# EAGLE design motordrive2 (EAGLE 7.6.0)
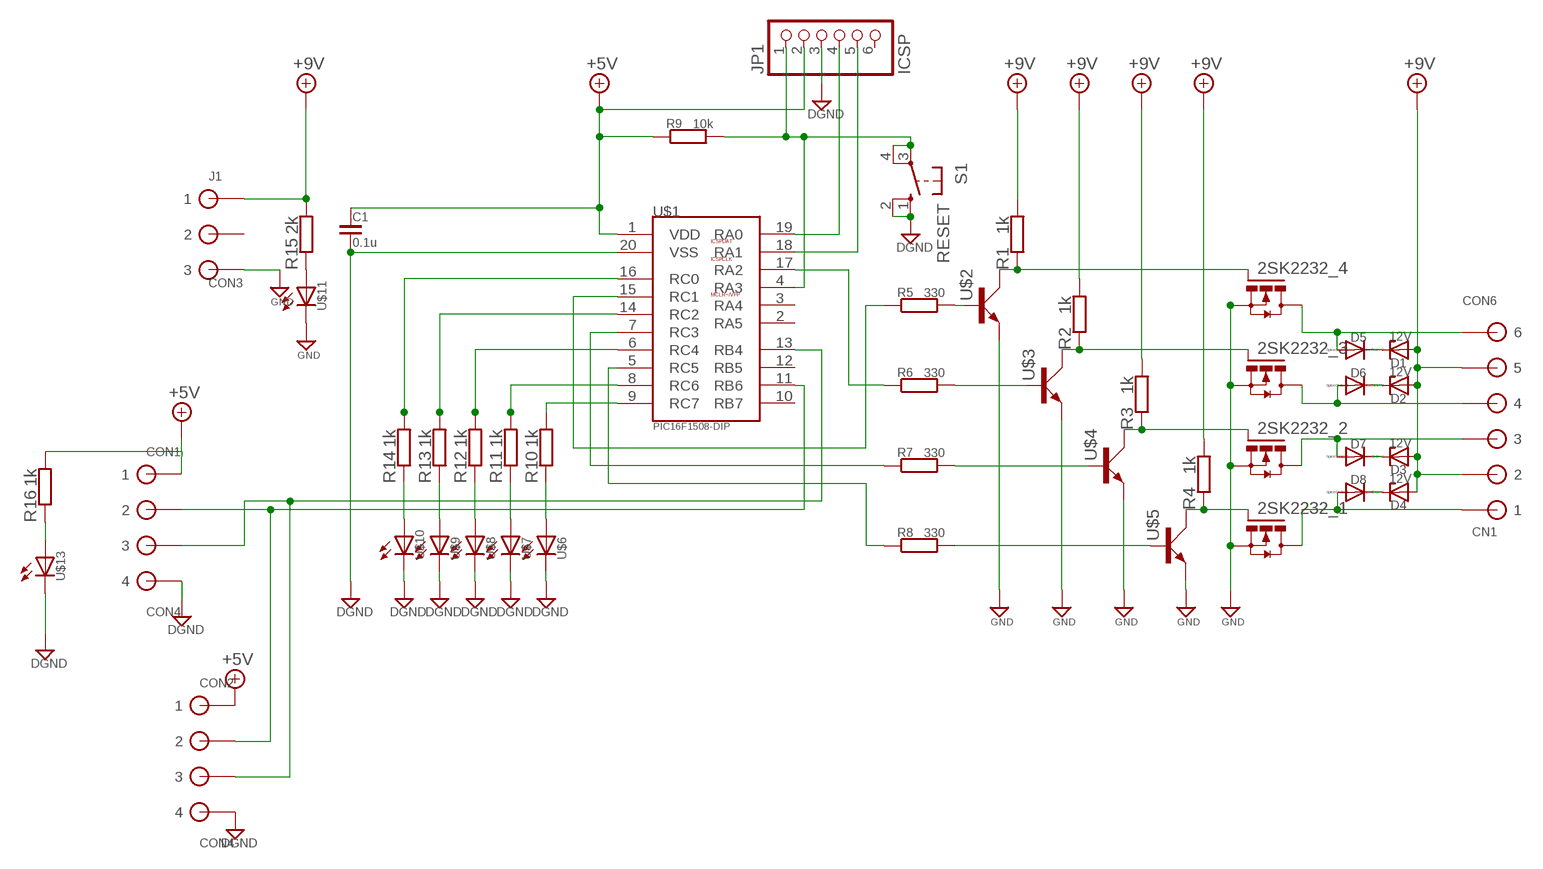
[diagram p0: schematic, sheet 1]

## Parts
2SK2232_1  TO-220(MOS-FET_N)  [TO-220]
2SK2232_2  TO-220(MOS-FET_N)  [TO-220]
2SK2232_3  TO-220(MOS-FET_N)  [TO-220]
2SK2232_4  TO-220(MOS-FET_N)  [TO-220]
C1  0.1u  (コンデンサ)セラミック075-032X103  [C075-032X103]
CN1  CON6  [CON6]
CON1  CON4  [CON4]
CON2  CON4  [CON4]
D1  12V  (汎用)ツェナーダイオードD=3  [DO41Z(D=3)]
D2  12V  (汎用)ツェナーダイオードD=3  [DO41Z(D=3)]
D3  12V  (汎用)ツェナーダイオードD=3  [DO41Z(D=3)]
D4  12V  (汎用)ツェナーダイオードD=3  [DO41Z(D=3)]
D5  (汎用)D=3  [DO41(D=3)]
D6  (汎用)D=3  [DO41(D=3)]
D7  (汎用)D=3  [DO41(D=3)]
D8  (汎用)D=3  [DO41(D=3)]
J1  CON3  [CON3]
JP1  ICSP  PINHD-1X6  [1X06]
R1  1k  抵抗(新JIS)0207/10  [0207/10]
R2  1k  抵抗(新JIS)0207/10  [0207/10]
R3  1k  抵抗(新JIS)0207/10  [0207/10]
R4  1k  抵抗(新JIS)0207/10  [0207/10]
R5  330  抵抗0207/10  [1/4W-H4_(0207/10)]
R6  330  抵抗0207/10  [1/4W-H4_(0207/10)]
R7  330  抵抗0207/10  [1/4W-H4_(0207/10)]
R8  330  抵抗0207/10  [1/4W-H4_(0207/10)]
R9  10k  抵抗0207/10  [1/4W-H4_(0207/10)]
R10  1k  抵抗(新JIS)0207/10  [0207/10]
R11  1k  抵抗(新JIS)0207/10  [0207/10]
R12  1k  抵抗(新JIS)0207/10  [0207/10]
R13  1k  抵抗(新JIS)0207/10  [0207/10]
R14  1k  抵抗(新JIS)0207/10  [0207/10]
R15  2k  抵抗(新JIS)0207/10  [0207/10]
R16  1k  抵抗(新JIS)0207/10  [0207/10]
S1  RESET  ノーマル4ピンタクトスイッチ  [B3F-10XX]
U$1  PIC16F1508-DIP  [DIP254P762X533-20]
U$2  TO-92(TRANSISTER_NPN)  [TO-92]
U$3  TO-92(TRANSISTER_NPN)  [TO-92]
U$4  TO-92(TRANSISTER_NPN)  [TO-92]
U$5  TO-92(TRANSISTER_NPN)  [TO-92]
U$6  LED(砲弾型)5  [LED5MM]
U$7  LED(砲弾型)5  [LED5MM]
U$8  LED(砲弾型)5  [LED5MM]
U$9  LED(砲弾型)5  [LED5MM]
U$10  LED(砲弾型)5  [LED5MM]
U$11  LED(砲弾型)5  [LED5MM]
U$13  LED(砲弾型)5  [LED5MM]

## Nets
+5V: C1.1 CON1.P$1 CON2.P$1 JP1.2 R9.1 R16.2 U$1.1(VDD)
+9V: CN1.P$2 CN1.P$5 D1.A D2.A D3.A D4.A J1.P$1 R1.2 R2.2 R3.2 R4.2 R15.2
DGND: C1.2 CON1.P$4 CON2.P$4 JP1.3 S1.1(S) S1.2(S1) U$1.20(VSS) U$6.K U$7.K U$8.K U$9.K U$10.K U$13.K
GND: 2SK2232_1.3(S) 2SK2232_2.3(S) 2SK2232_3.3(S) 2SK2232_4.3(S) J1.P$3 U$2.1(E) U$3.1(E) U$4.1(E) U$5.1(E) U$11.K
N$1: 2SK2232_1.2(D) CN1.P$1 D8.A
N$2: 2SK2232_2.2(D) CN1.P$3 D7.A
N$3: 2SK2232_3.2(D) CN1.P$4 D6.A
N$4: 2SK2232_4.2(D) CN1.P$6 D5.A
N$5: R8.1 U$1.5(RC5)
N$6: R5.1 U$1.15(RC1)
N$7: R7.1 U$1.7(RC3)
N$8: 2SK2232_3.1(G) R2.1 U$3.2(C)
N$9: CON1.P$2 CON2.P$2 U$1.11(RB6)
N$10: R15.1 U$11.A
N$11: 2SK2232_4.1(G) R1.1 U$2.2(C)
N$12: R6.1 U$1.17(RA2)
N$13: 2SK2232_2.1(G) R3.1 U$4.2(C)
N$14: 2SK2232_1.1(G) R4.1 U$5.2(C)
N$15: R5.2 U$2.3(B)
N$16: R6.2 U$3.3(B)
N$17: R7.2 U$4.3(B)
N$18: R8.2 U$5.3(B)
N$19: JP1.4 U$1.19(RA0)
N$20: JP1.5 U$1.18(RA1)
N$21: JP1.1 R9.2 S1.3(P) S1.4(P1) U$1.4(RA3)
N$22: R16.1 U$13.A
N$23: R10.1 U$6.A
N$24: R10.2 U$1.9(RC7)
N$25: R11.2 U$1.8(RC6)
N$26: R12.2 U$1.6(RC4)
N$27: R13.2 U$1.14(RC2)
N$28: R14.2 U$1.16(RC0)
N$29: R11.1 U$7.A
N$30: R12.1 U$8.A
N$31: R13.1 U$9.A
N$32: D1.C D5.C
N$33: D2.C D6.C
N$34: D3.C D7.C
N$35: D4.C D8.C
N$36: R14.1 U$10.A
N$37: CON1.P$3 CON2.P$3 U$1.13(RB4)
Unconnected: J1.P$2 JP1.6 U$1.2(RA5) U$1.3(RA4) U$1.10(RB7) U$1.12(RB5)

## Library data of the parts
2SK2232_1-2SK2232_4 = (半導体)FET＆トランジスタ:TO-220(MOS-FET_N)
C1 = (Foundation)セラミックコンデンサ:(コンデンサ)セラミック: CAPACITOR, European symbol
CN1 = _XH-con(XHｺﾈｸﾀ):CON6: low insertion connector 6
CON1 CON2 = _XH-con(XHｺﾈｸﾀ):CON4: Low insertion connector 4pin
D1-D4 = (半導体)ダイオード:(汎用)ツェナーダイオード: Z DIODE 3.3 V, 1W, 5 percent
D5-D8 = (半導体)ダイオード:(汎用): DIODE general purpose rectifier, 1 A
J1 = (コネクタ)XH:CON3: low insertion CON
JP1 = (コネクタ)ピンヘッダ:PINHD-1X6: PIN HEADER
R1-R4 R10-R16 = 0RCL:抵抗(新JIS): RESISTOR, European symbol
R5-R9 = (Foundation)抵抗:抵抗: RESISTOR, European symbol
S1 = (スイッチ)タクトスイッチ:ノーマル4ピンタクトスイッチ: OMRON SWITCH; MPN: B3F-1000; OC_FARNELL: 176432; OC_NEWARK: 36M3542
U$1 = (マイコン)PIC:PIC16F1508-DIP
U$2-U$5 = (半導体)FET＆トランジスタ:TO-92(TRANSISTER_NPN)
U$6-U$11 U$13 = (半導体)LED:LED(砲弾型)

## Board
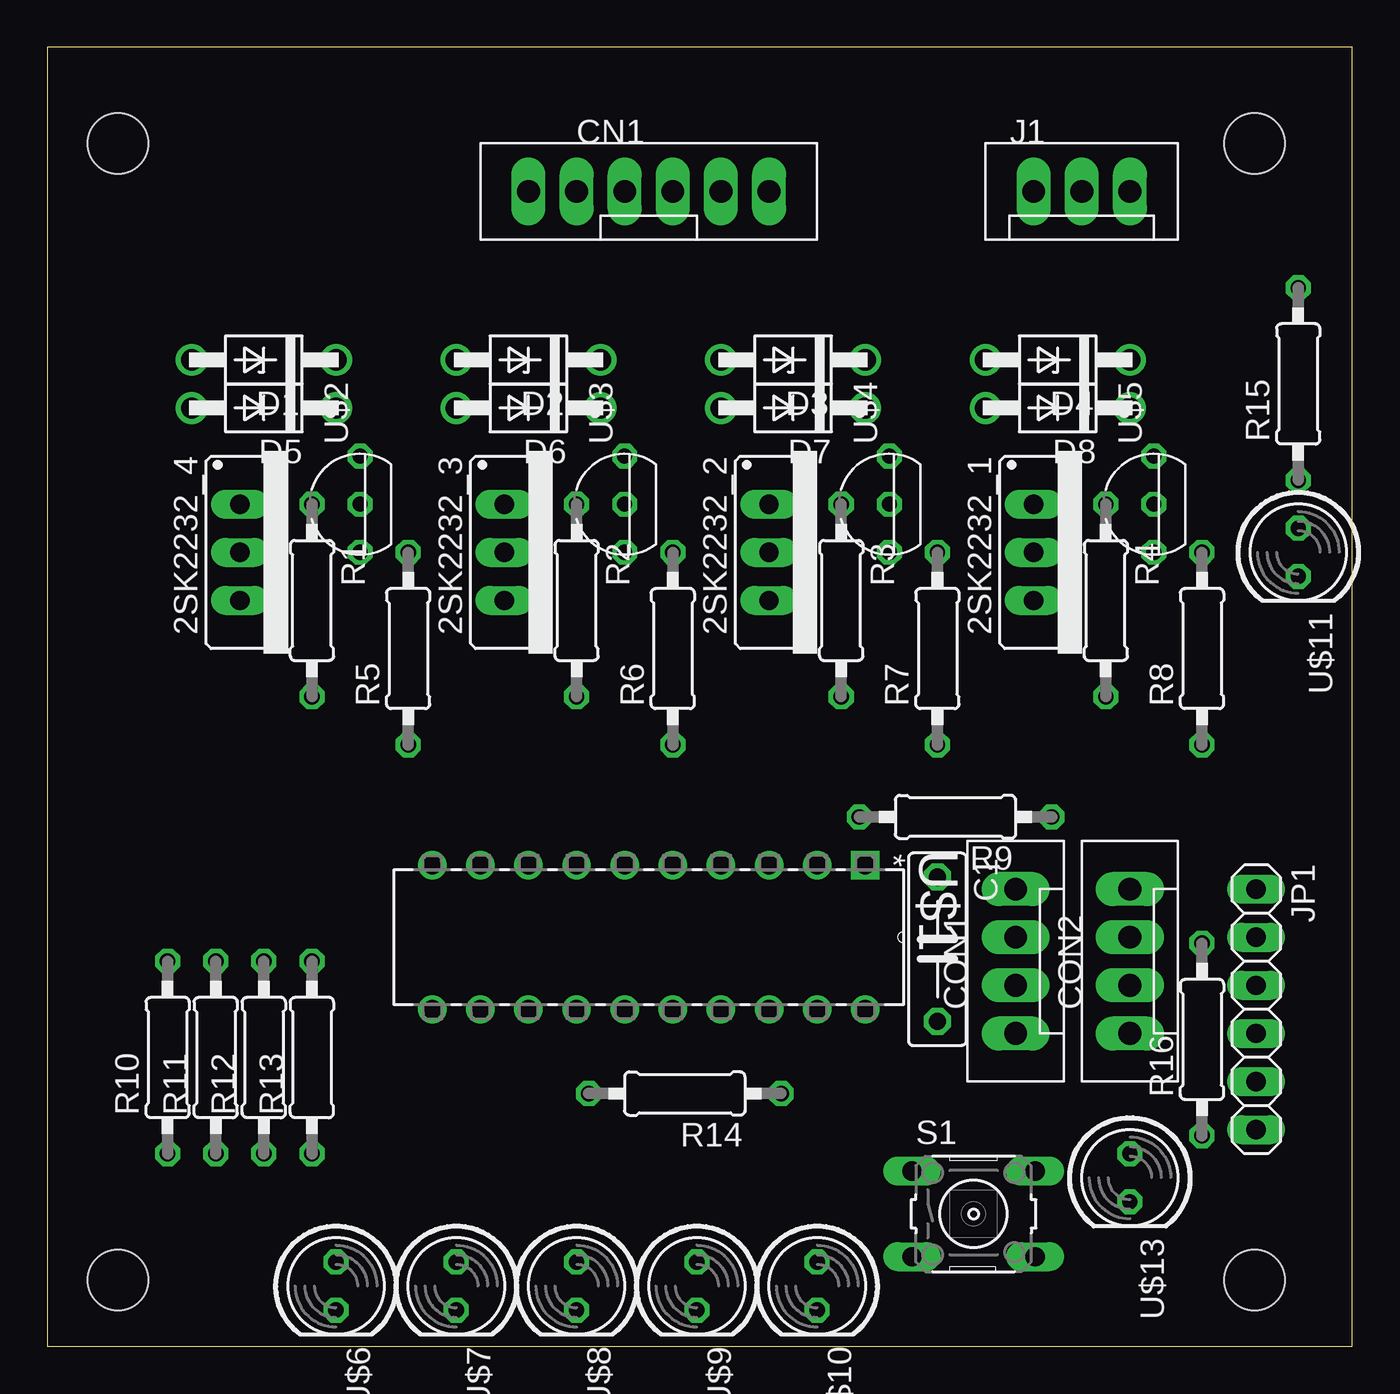
[diagram p1: board, top side]
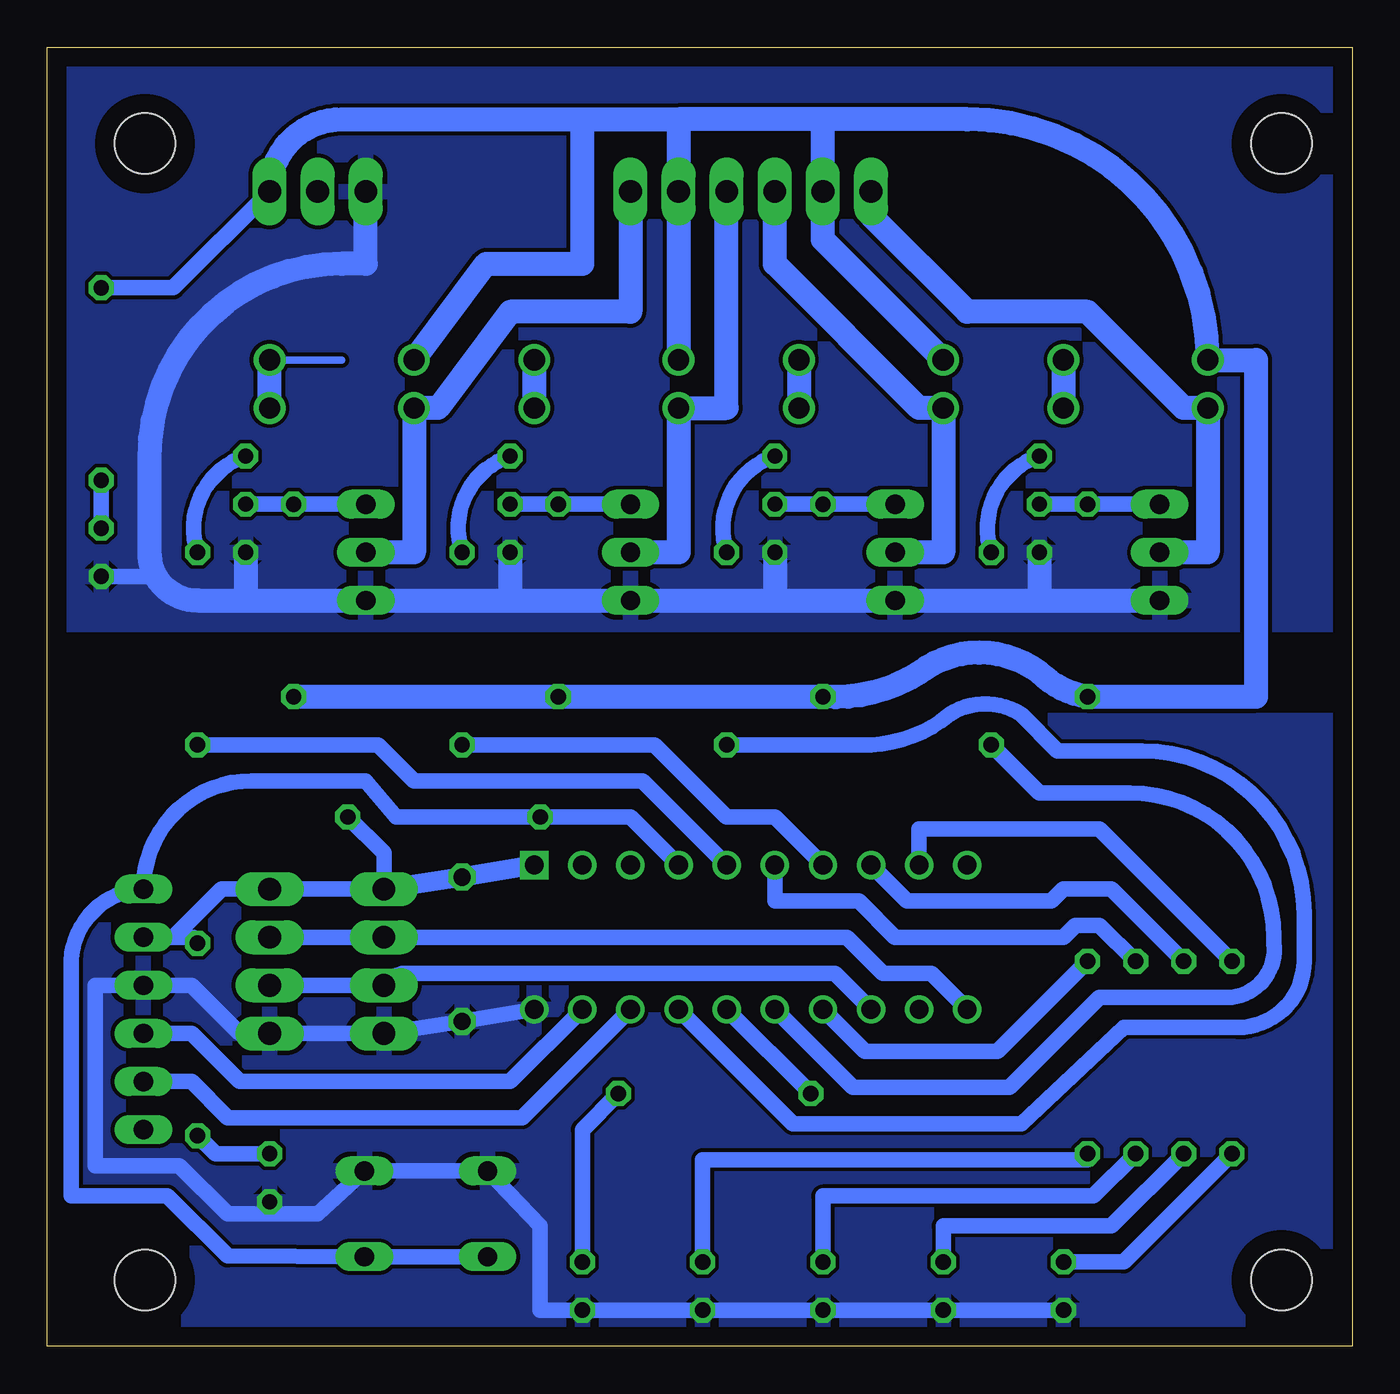
[diagram p2: board, bottom side, seen from below]

Size 68.89 x 68.57 mm. Coordinates in mm from the lower left corner, seen from the top.
Outline: 0,0 68.89,0 68.89,68.57 0,68.57 0,0
Copper layers (1*16): Top 0.035mm / dielectric 1.5mm / Bottom 0.035mm
Design rules "default": minimum track width 10mil, minimum drill 24mil, track to track 8mil, track to pad 8mil, pad to pad 8mil, via to via 8mil, smd to smd 8mil, copper to edge 40mil, drill to drill 8mil, minimum pad ring 10mil, minimum via ring 8mil, stop-mask expansion 4mil, vias tented up to drill 0mil, thermal gap 10mil
Holes 3.2 mm at 3.73,63.49 63.73,63.49 63.73,3.49 3.73,3.49

### Footprints (pad centres in the part's own frame; a part is rotated, then mirrored left to right if it is on the bottom)
TO-220 = drill 1.016 long: 1 -2.54,0; 2 0,0; 3 2.54,0
C075-032X103 = drill 0.914 octagon: 1 -3.81,0; 2 3.81,0
CON6 = drill 1.2 long: P$1 6.35,0; P$2 3.81,0; P$3 1.27,0; P$4 -1.27,0; P$5 -3.81,0; P$6 -6.35,0
CON4 = drill 1.2 long: P$1 3.81,0; P$2 1.27,0; P$3 -1.27,0; P$4 -3.81,0
DO41Z(D=3) = drill 1.118: A 3.81,0; C -3.81,0
DO41(D=3) = drill 1.118: A 3.81,0; C -3.81,0
CON3 = drill 1.2 long: P$1 2.54,0; P$2 0,0; P$3 -2.54,0
1X06 = drill 1.016 long: 1 -6.35,0; 2 -3.81,0; 3 -1.27,0; 4 1.27,0; 5 3.81,0; 6 6.35,0
0207/10 = drill 0.813 octagon: 1 -5.08,0; 2 5.08,0
1/4W-H4_(0207/10) = drill 0.813 octagon: 1 -5.08,0; 2 5.08,0
B3F-10XX = drill 1.016 long: 1 -3.251,2.261; 2 3.251,2.261; 3 -3.251,-2.261; 4 3.251,-2.261
DIP254P762X533-20 = drill 0.991 square: 1 -7.62,22.86 | drill 0.991: 2 -7.62,20.32; 3 -7.62,17.78; 4 -7.62,15.24; 5 -7.62,12.7; 6 -7.62,10.16; 7 -7.62,7.62; 8 -7.62,5.08; 9 -7.62,2.54; 10 -7.62,0; 11 0,0; 12 0,2.54; 13 0,5.08; 14 0,7.62; 15 0,10.16; 16 0,12.7; 17 0,15.24; 18 0,17.78; 19 0,20.32; 20 0,22.86
TO-92 = drill 0.8 octagon: 1 -2.54,0; 2 0,0; 3 2.54,0
LED5MM = drill 0.813 octagon: A -1.27,0; K 1.27,0

### Placement (x,y rotation side)
2SK2232_1  52.07,41.91 270 top
2SK2232_2  38.1,41.91 270 top
2SK2232_3  24.13,41.91 270 top
2SK2232_4  10.16,41.91 270 top
C1  46.99,20.95 270 top
CN1  31.75,60.96 0 top
CON1  51.12,20.32 90 top
CON2  57.15,20.32 90 top
D1  11.43,52.07 180 top
D2  25.4,52.07 180 top
D3  39.37,52.07 180 top
D4  53.34,52.07 180 top
D5  11.43,49.53 180 top
D6  25.4,49.53 180 top
D7  39.37,49.53 180 top
D8  53.34,49.53 180 top
J1  54.61,60.96 0 top
JP1  63.82,17.78 270 top
R1  13.97,39.37 270 top
R2  27.94,39.37 270 top
R3  41.91,39.37 270 top
R4  55.88,39.37 270 top
R5  19.05,36.83 90 top
R6  33.02,36.83 90 top
R7  46.99,36.83 90 top
R8  60.96,36.83 90 top
R9  47.94,27.94 180 top
R10  6.35,15.24 90 top
R11  8.89,15.24 90 top
R12  11.43,15.24 90 top
R13  13.97,15.24 90 top
R14  33.66,13.34 180 top
R15  66.04,50.8 90 top
R16  60.96,16.19 90 top
S1  48.9,6.99 0 top
U$1  20.32,17.78 270 top
U$2  16.51,44.45 90 top
U$3  30.48,44.45 90 top
U$4  44.45,44.45 90 top
U$5  58.42,44.45 90 top
U$6  15.24,3.17 270 top
U$7  21.59,3.17 270 top
U$8  27.94,3.17 270 top
U$9  34.29,3.17 270 top
U$10  40.64,3.17 270 top
U$11  66.04,41.91 270 top
U$13  57.15,8.89 270 top

### Tracks (layer width: path | path; a pad name or v marks a point on that pad's centre or on a via)
+5V
  Bottom 0.813: 62.23,21.59 59.69,24.13 CON2.P$1 CON1.P$1 51.12,26.04 R9.1 | 62.23,21.59 JP1.2 | 62.23,21.59 61.28,21.59 arc90 R16.2
  Bottom 1.016: CON1.P$1 C1.1 U$1.1
+9V
  Bottom 0.813: R15.2 62.23,55.88 J1.P$1
  Bottom 1.27: D2.A 27.94,58.42 CN1.P$5 27.94,64.77 | 27.94,64.77 20.32,64.77 arc90 D1.A 5.08,52.07 5.08,34.29 R1.2 arc37 16.51,35.56 arc-74 22.86,35.56 arc37 R2.2 R3.2 R4.2 | 27.94,64.77 35.56,64.77 | 35.56,64.77 CN1.P$2 D3.A | D4.A 45.72,57.15 40.64,57.15 40.64,64.77 | 40.64,64.77 35.56,64.77 | J1.P$1 arc90 53.34,64.77 40.64,64.77
DGND
  Bottom 0.813: U$1.20 C1.2 CON1.P$4 CON2.P$4 58.74,16.51 61.28,19.05 JP1.3 | U$6.K U$7.K U$8.K U$9.K U$10.K 42.86,1.91 42.86,6.35 S1.1 S1.2 54.61,6.99 57.15,6.99 | JP1.3 66.36,19.05 66.36,9.53 61.91,9.53 59.37,6.99 57.15,6.99 | 62.87,19.05 JP1.3 | U$13.K 57.15,6.99
  pour Bottom: 69.85,0 0,0 0,33.02 69.85,33.02
GND
  Bottom 0.813: U$11.K 63.18,40.64 61.91,39.37 60.96,39.37
  Bottom 1.27: 58.42,39.37 2SK2232_1.3 44.45,39.37 | U$4.1 44.45,39.37 | 44.45,39.37 2SK2232_2.3 30.48,39.37 | U$3.1 30.48,39.37 | 30.48,39.37 2SK2232_3.3 16.51,39.37 | U$2.1 16.51,39.37 | 16.51,39.37 2SK2232_4.3 | U$5.1 58.42,39.37 | J1.P$3 52.07,57.15 53.34,57.15 arc-90 63.5,46.99 63.5,41.91 arc-90 60.96,39.37 58.42,39.37
  pour Bottom: 0,68.58 69.85,68.58 69.85,38.1 0,38.1
N$1
  Bottom 1.27: 2SK2232_1.2 49.53,41.91 D8.A 48.26,49.53 44.45,54.61 38.1,54.61 CN1.P$1
N$2
  Bottom 1.27: 2SK2232_2.2 35.56,41.91 D7.A 33.02,49.53 CN1.P$3
N$3
  Bottom 1.27: 2SK2232_3.2 21.59,41.91 D6.A 22.86,49.53 30.48,57.15 CN1.P$4
N$4
  Bottom 1.27: 2SK2232_4.2 7.62,41.91 D5.A 8.89,49.53 13.97,54.61 20.32,54.61 25.4,59.69 CN1.P$6
N$5
  Bottom 0.813: R8.1 51.44,31.75 49.53,29.84 37.47,29.84 U$1.5
N$6
  Bottom 0.813: U$1.15 26.35,13.65 18.1,13.65 13.34,18.41 6.35,18.41 arc-90 4.13,21.27 4.13,21.59 arc-90 11.75,29.21 16.51,29.21 R5.1
N$7
  Bottom 0.813: R7.1 36.83,31.75 33.02,27.94 30.48,27.94 U$1.7
N$8
  Bottom 0.813: U$3.2 R2.1 2SK2232_3.1
N$9
  Bottom 0.813: U$1.11 22.23,19.68 24.77,19.68 26.67,21.59 CON1.P$2 CON2.P$2
N$10
  Bottom 0.813: R15.1 U$11.A
N$11
  Bottom 0.813: U$2.2 R1.1 2SK2232_4.1
N$12
  Bottom 0.813: R6.1 25.4,31.75 arc-37 21.27,33.34 arc67 17.46,33.34 15.56,31.43 11.11,31.43 arc90 2.54,22.86 2.54,20.32 arc90 6.03,16.83 12.06,16.83 17.46,11.75 29.53,11.75 U$1.17
N$13
  Bottom 0.813: U$4.2 R3.1 2SK2232_2.1
N$14
  Bottom 0.813: U$5.2 R4.1 2SK2232_1.1
N$15
  Bottom 0.813: R5.2 arc90 U$2.3
N$16
  Bottom 0.813: R6.2 arc90 U$3.3
N$17
  Bottom 0.813: R7.2 arc90 U$4.3
N$18
  Bottom 0.813: R8.2 arc90 U$5.3
N$19
  Bottom 0.813: U$1.19 44.45,13.97 58.74,13.97 61.28,16.51 JP1.4
N$20
  Bottom 0.813: U$1.18 43.81,12.06 59.37,12.06 61.28,13.97 JP1.5
N$21
  Bottom 0.813: U$1.4 38.1,27.94 R9.2 50.48,27.94 52.07,29.84 58.1,29.84 arc-90 JP1.1 arc-90 67.63,20 67.63,7.94 62.55,7.94 59.37,4.76 S1.4 S1.3
N$22
  Bottom 0.813: R16.1 60.01,10.16 U$13.A
N$23
  Bottom 0.813: R10.1 12.06,4.45 U$6.A
N$24
  Bottom 0.813: U$1.9 22.86,27.3 13.34,27.3 R10.2
N$25
  Bottom 0.813: U$1.8 23.5,23.5 15.88,23.5 15.24,24.13 12.7,24.13 R11.2
N$26
  Bottom 0.813: U$1.6 30.48,23.5 26.04,23.5 24.13,21.59 15.24,21.59 14.61,22.23 13.34,22.23 R12.2
N$27
  Bottom 0.813: U$1.14 25.72,15.56 18.73,15.56 R13.2
N$28
  Bottom 0.813: U$1.16 R14.2
N$29
  Bottom 0.813: R11.1 12.7,6.35 21.59,6.35 U$7.A
N$30
  Bottom 0.813: R12.1 13.65,7.94 27.94,7.94 U$8.A
N$31
  Bottom 0.813: R13.1 13.97,9.84 34.29,9.84 U$9.A
N$32
  Bottom 1.27: D1.C D5.C
N$33
  Bottom 1.27: D2.C D6.C
N$34
  Bottom 1.27: D3.C D7.C
N$35
  Bottom 0.406: D4.C 53.34,52.07
  Bottom 1.27: D8.C D4.C
N$36
  Bottom 0.813: R14.1 40.64,11.43 U$10.A
N$37
  Bottom 0.813: U$1.13 27.3,19.68 50.16,19.68 52.07,19.05 CON1.P$3 CON2.P$3